# Altium schematic sheet FilterControl.Schematic.SchDoc
size A
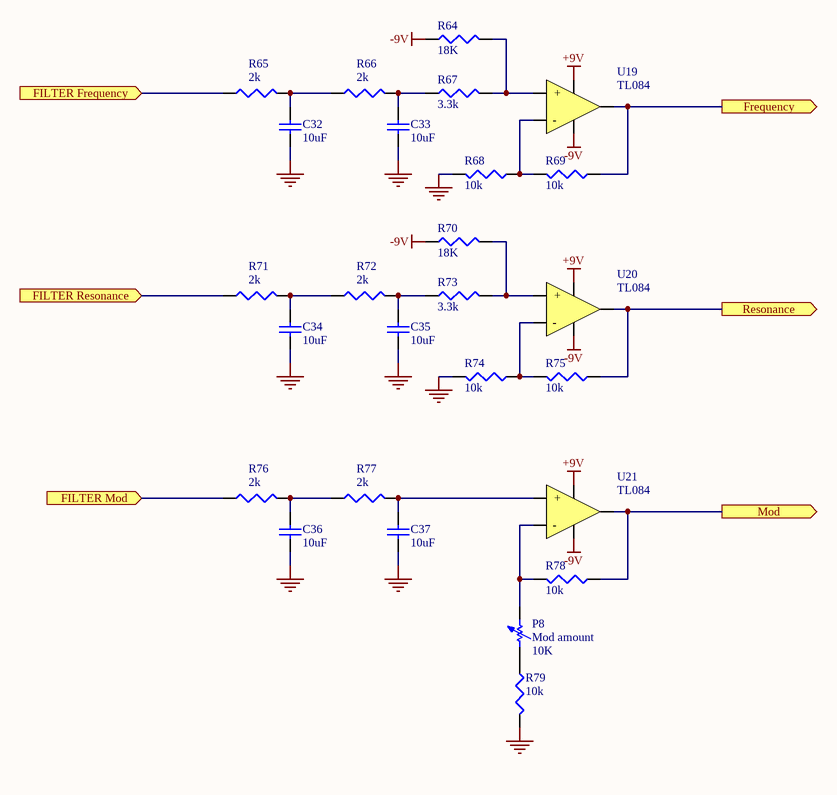
[diagram p0: FilterControl.Schematic.SchDoc]

## Parts
C32  10uF  [CAPC1608N]
C33  10uF  [CAPC1608N]
C34  10uF  [CAPC1608N]
C35  10uF  [CAPC1608N]
C36  10uF  [CAPC1608N]
C37  10uF  [CAPC1608N]
P8  Mod amount  value 10K  [AXIAL-0.7]
R64  18K  [CAPC1608N]
R65  2k  [CAPC1608N]
R66  2k  [CAPC1608N]
R67  3.3k  [CAPC1608N]
R68  10k  [CAPC1608N]
R69  10k  [CAPC1608N]
R70  18K  [CAPC1608N]
R71  2k  [CAPC1608N]
R72  2k  [CAPC1608N]
R73  3.3k  [CAPC1608N]
R74  10k  [CAPC1608N]
R75  10k  [CAPC1608N]
R76  2k  [CAPC1608N]
R77  2k  [CAPC1608N]
R78  10k  [CAPC1608N]
R79  10k  [CAPC1608N]
U19  TL084  [TL084]
U20  TL084  [TL084]
U21  TL084  [TL084]

## Ports
FILTER Frequency (in), FILTER Mod (in), FILTER Resonance (in), Frequency (out), Mod (out), Resonance (out)

## Nets
+9V: U19.4(VCC+) U20.4(VCC+) U21.4(VCC+)
-9V: R64.1 R70.1 U19.11(VCC-) U20.11(VCC-) U21.11(VCC-)
GND: C32.1 C33.1 C34.1 C35.1 C36.1 C37.1 R68.2 R74.2 R79.2
FILTER Frequency: R65.1 ; port FILTER Frequency
FILTER Mod: R76.1 ; port FILTER Mod
FILTER Resonance: R71.1 ; port FILTER Resonance
Frequency: R69.1 U19.1(OUT) ; port Frequency
Mod: R78.1 U21.1(OUT) ; port Mod
Resonance: R75.1 U20.1(OUT) ; port Resonance
NetC32_2: C32.2 R65.2 R66.1
NetC33_2: C33.2 R66.2 R67.1
NetC34_2: C34.2 R71.2 R72.1
NetC35_2: C35.2 R72.2 R73.1
NetC36_2: C36.2 R76.2 R77.1
NetC37_2: C37.2 R77.2 U21.2(+)
NetP8_1: P8.1 R79.1
NetP8_2: P8.2 R78.2 U21.3(-)
NetR64_2: R64.2 R67.2 U19.2(+)
NetR68_1: R68.1 R69.2 U19.3(-)
NetR70_2: R70.2 R73.2 U20.2(+)
NetR74_1: R74.1 R75.2 U20.3(-)

## Library data of the parts
C32-C37 = Cap Semi: Capacitor (Semiconductor SIM Model); Value: 10u; Published: 8-Jun-2000; LatestRevisionDate: 29-May-2009; LatestRevisionNote: IPC-7351 Footprint Added.; PackageReference: C1206; Publisher: Altium Limited; PackageDescription: Chip Capacitor
P8 = Res Adj1: Variable Resistor; Set Position: 0.5; Published: 8-Jun-2000; LatestRevisionDate: 17-Jul-2002; LatestRevisionNote: Re-released for DXP Platform.; PackageReference: AXIAL-0.7; Publisher: Altium Limited; PackageDescription: Axial Device, Thru-Hole; 2 Leads; 0.7 in Pin Spacing
R64-R79 = Res3: Resistor; Published: 8-Jun-2000; LatestRevisionDate: 29-May-2009; LatestRevisionNote: IPC-7351 Footprint Added.; PackageReference: J1-0603; Publisher: Altium Limited; PackageDescription: Chip Resistor
  R64 R70: Value: 18K
  R65 R66 R71 R72 R76 R77: Value: 2K
  R67 R73: Value: 3.3K
  R68 R69 R74 R75 R78 R79: Value: 10K